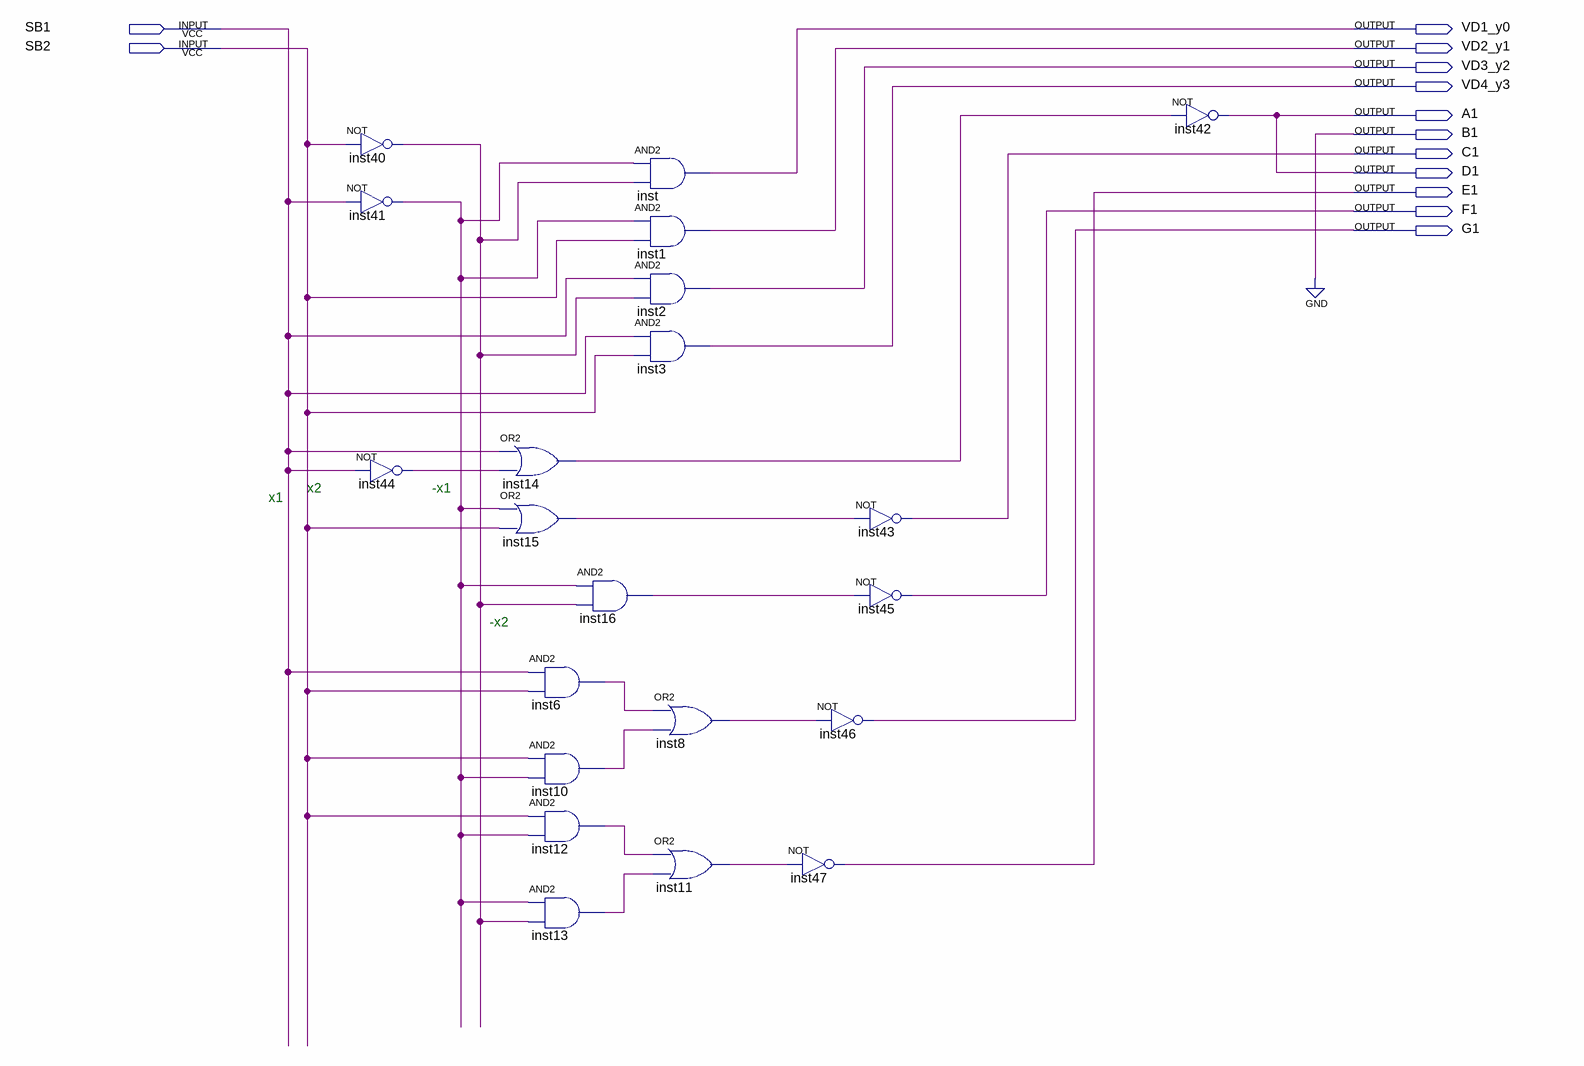
[diagram p0: schematic sheet]
// Quartus schematic sss2.bdf as structural Verilog: 21 symbols, 13 pins
module sss2 (
  input  SB1,
  input  SB2,
  output VD1_y0,
  output VD2_y1,
  output VD3_y2,
  output VD4_y3,
  output A1,
  output B1,
  output C1,
  output D1,
  output E1,
  output F1,
  output G1
);

  wire inst6_out, inst8_out, inst10_out, inst11_out, inst12_out, inst13_out, inst14_out, inst15_out,
       inst16_out, inst40_out, inst41_out, inst44_out;

  not inst40 (inst40_out, SB2);
  not inst41 (inst41_out, SB1);
  not inst44 (inst44_out, SB1);
  or inst14 (inst14_out, SB1, inst44_out);
  or inst15 (inst15_out, inst41_out, SB2);
  and inst6 (inst6_out, SB1, SB2);
  and inst10 (inst10_out, SB2, inst41_out);
  and inst12 (inst12_out, SB2, inst41_out);
  and inst13 (inst13_out, inst41_out, inst40_out);
  and inst (VD1_y0, inst41_out, inst40_out);
  and inst1 (VD2_y1, inst41_out, SB2);
  and inst2 (VD3_y2, SB1, inst40_out);
  and inst3 (VD4_y3, SB1, SB2);
  and inst16 (inst16_out, inst41_out, inst40_out);
  or inst8 (inst8_out, inst6_out, inst10_out);
  or inst11 (inst11_out, inst12_out, inst13_out);
  not inst47 (E1, inst11_out);
  not inst43 (C1, inst15_out);
  not inst45 (F1, inst16_out);
  not inst46 (G1, inst8_out);
  not inst42 (A1, inst14_out);

  assign B1 = 1'b0;
  assign D1 = A1;

  // Notes on the sheet:
  //   x2
  //   -x1
  //   x1
  //   -x2
endmodule
